# EAGLE board MotionDetectorCamera-Rev4 (EAGLE 9.6.2), part 1 of 2
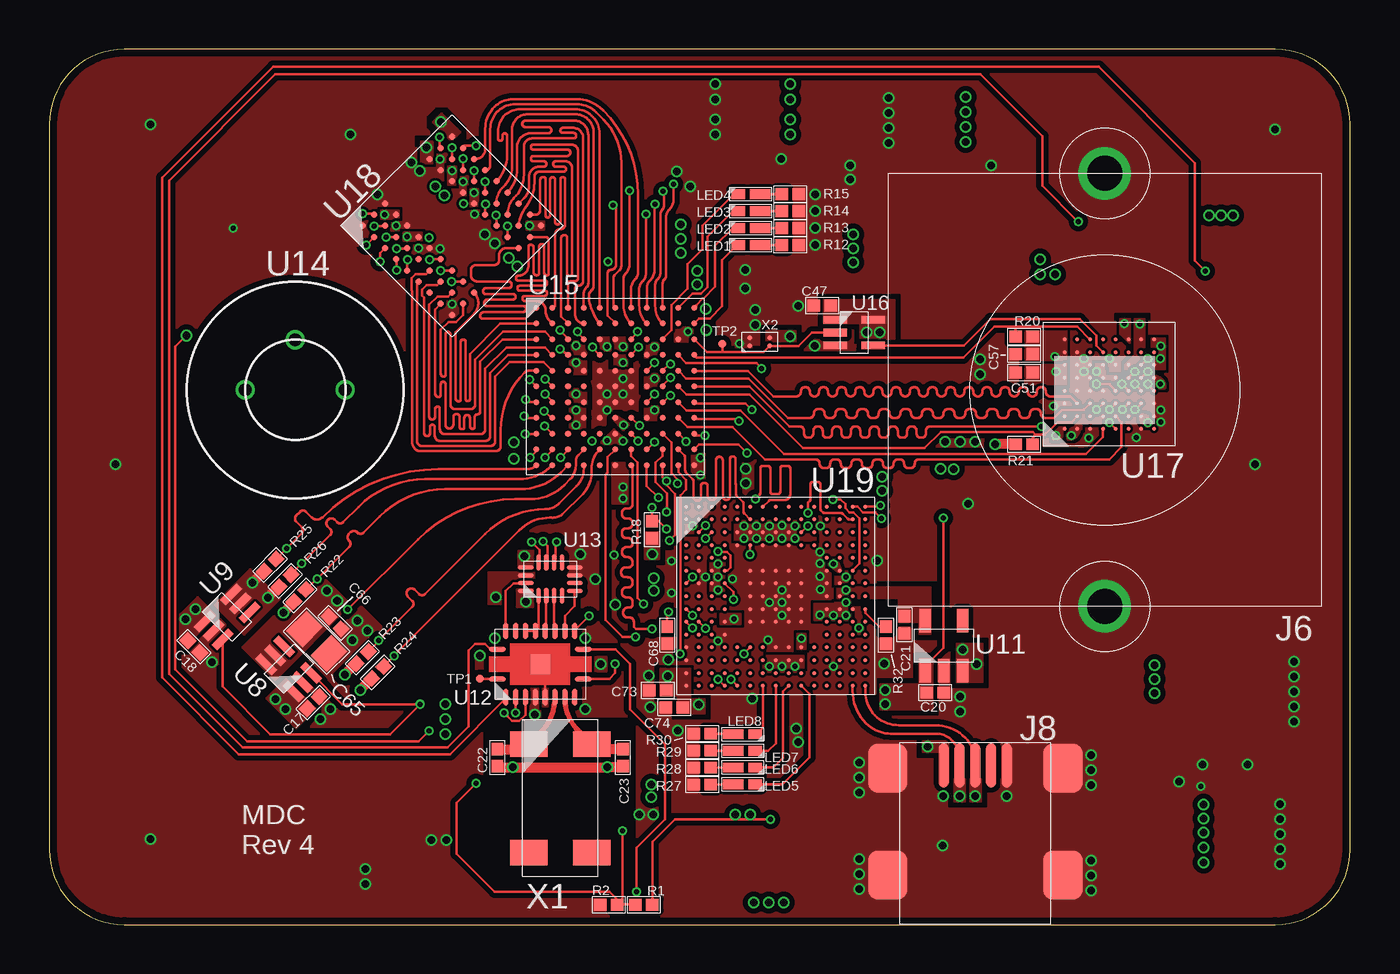
[diagram p9: board, top side]
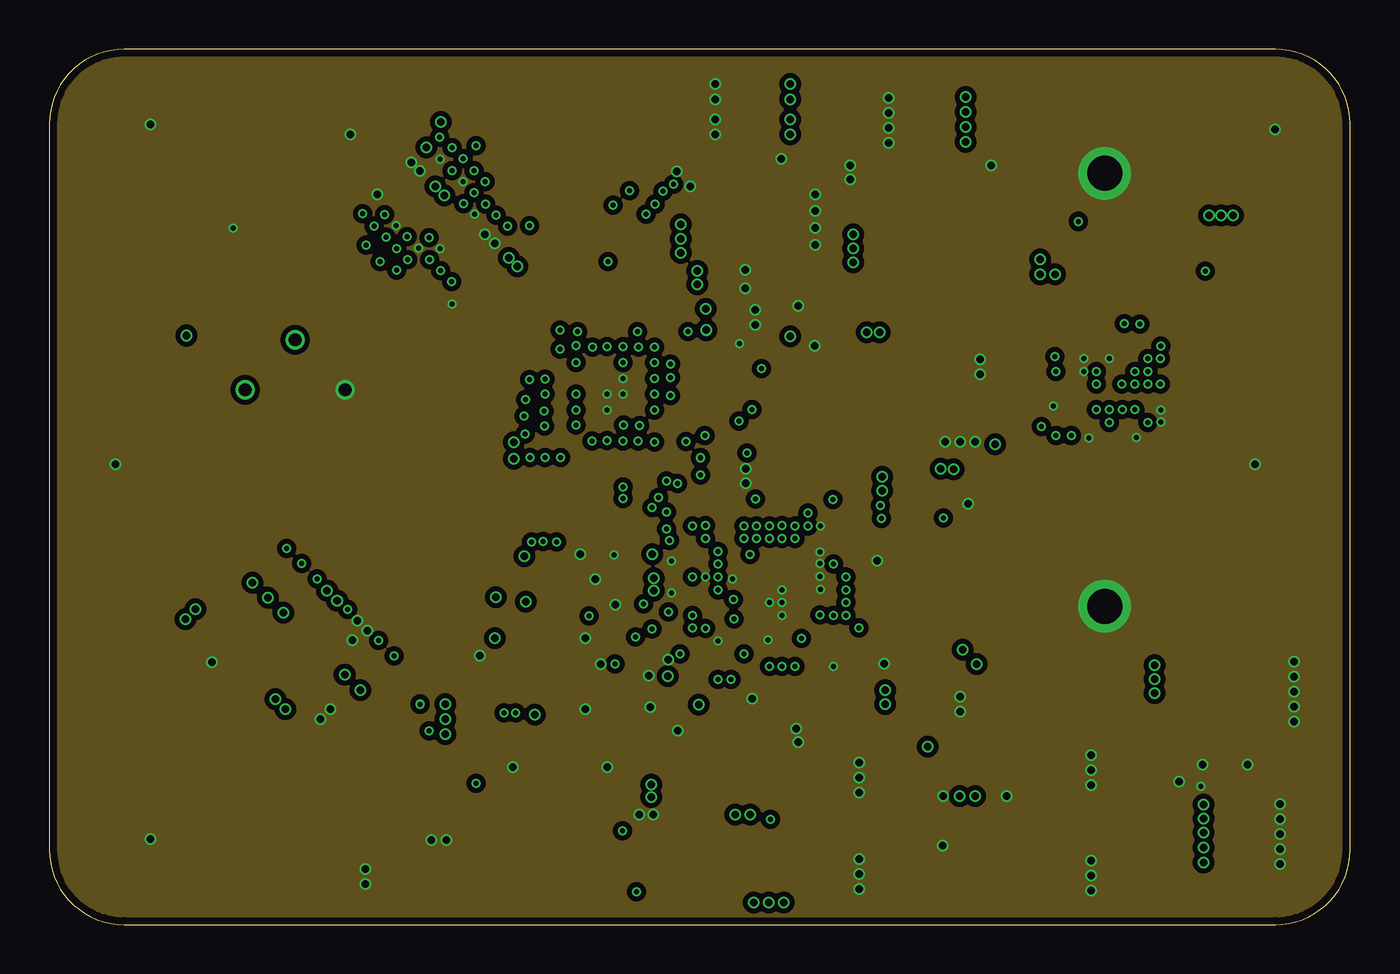
[diagram p10: board, inner layer Ground]
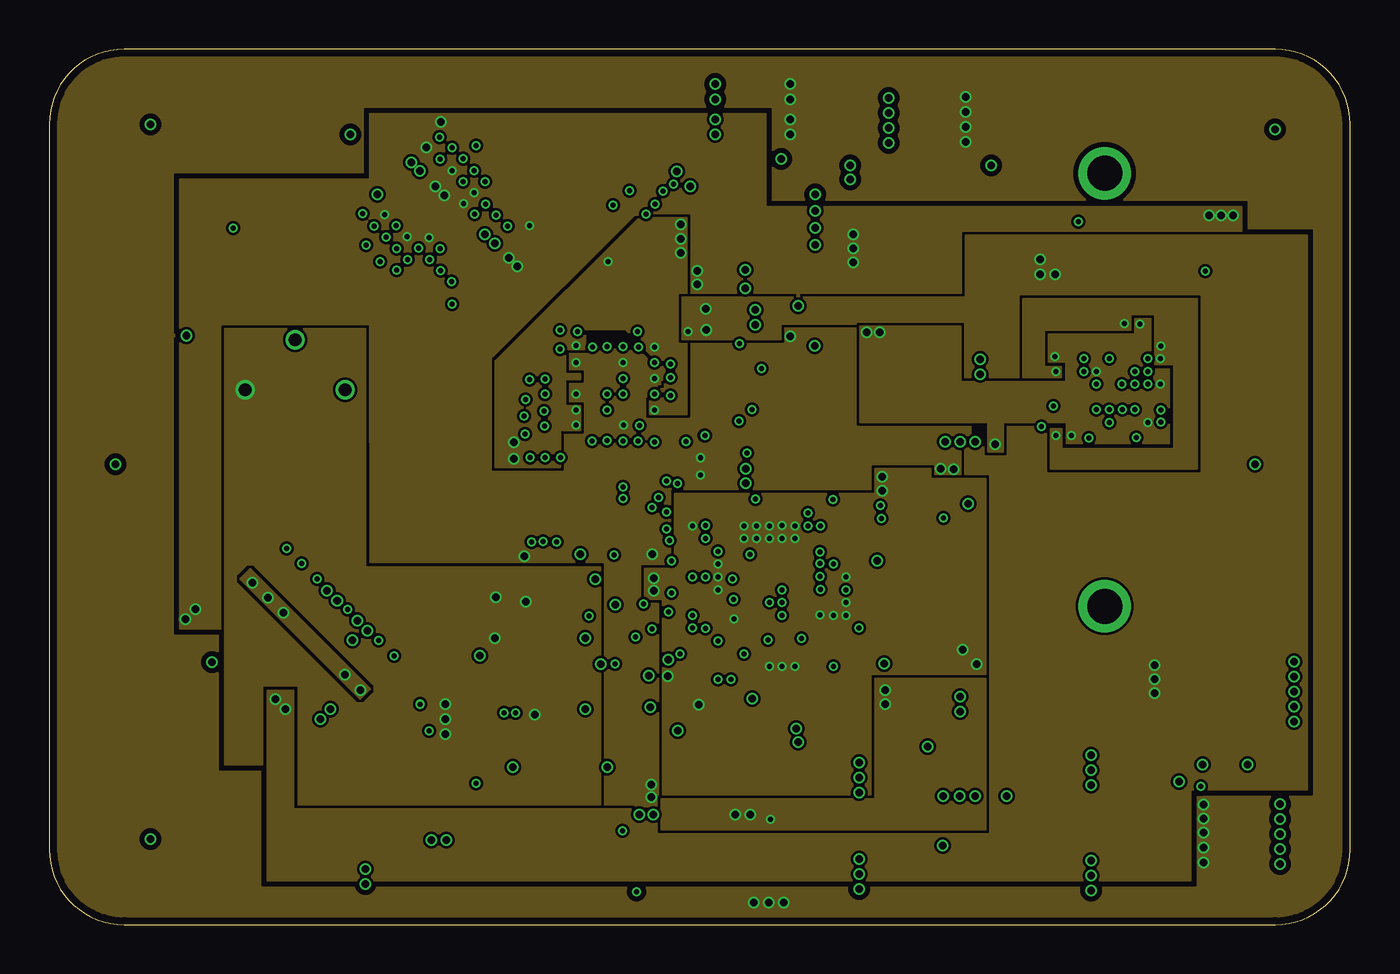
[diagram p11: board, inner layer Power]
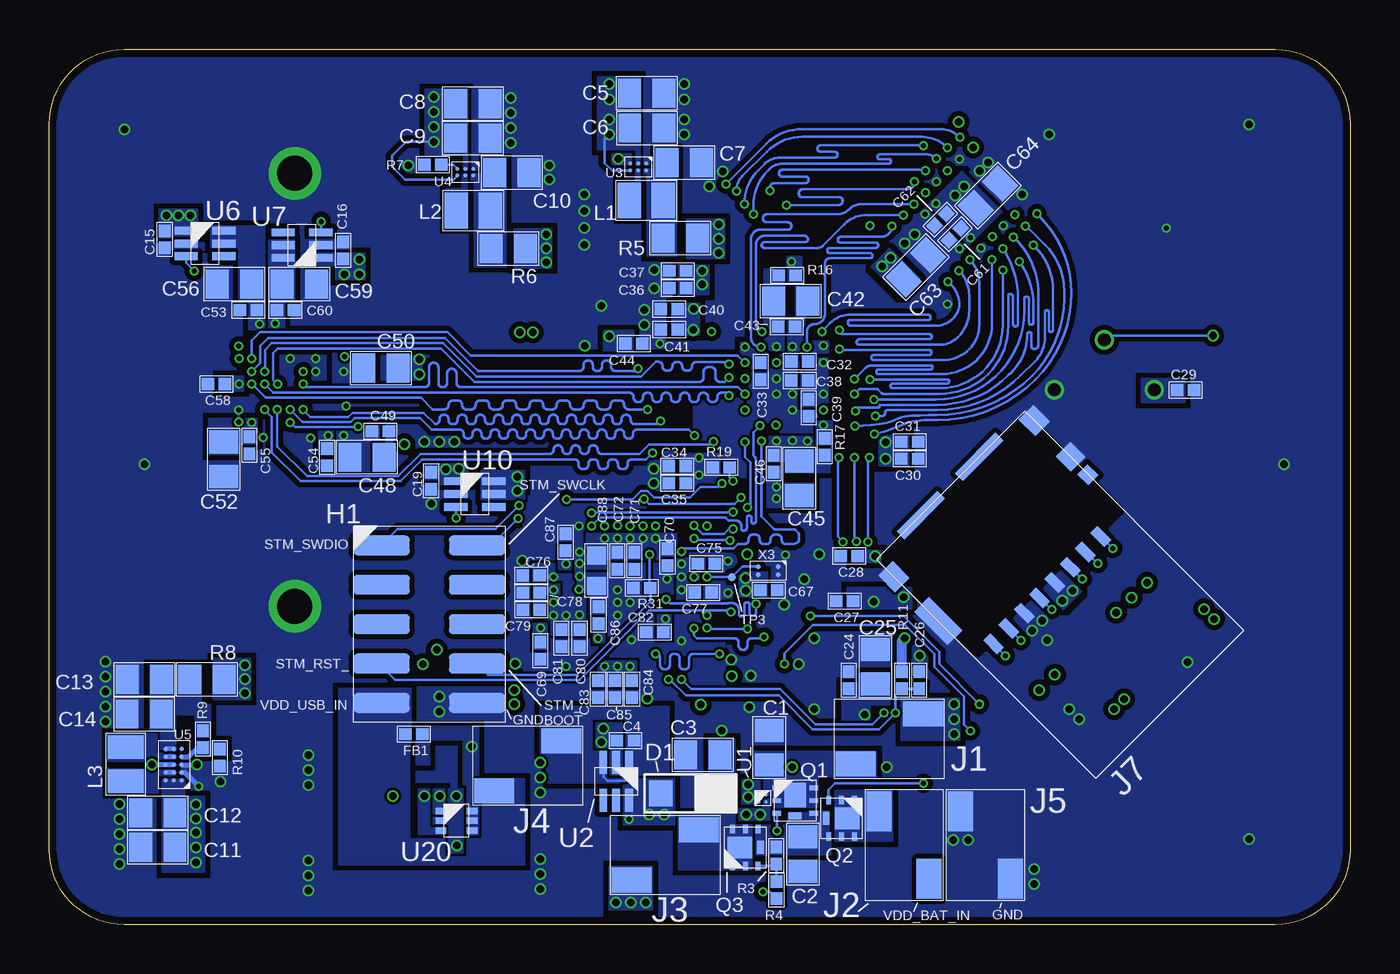
[diagram p12: board, bottom side, seen from below]

Size 66.09 x 44.48 mm. Coordinates in mm from the lower left corner, seen from the top.
Outline: 0,40.66 0,3.81 arc90 3.81,0 62.28,0 arc90 66.09,3.81 66.09,40.66 arc90 62.28,44.48 3.81,44.48 arc90 0,40.66
Copper layers (1*2*15*16): Top 0.035559375mm / dielectric 0.17018125mm / Ground 0.01778125mm / dielectric 47mil / Power 0.01778125mm / dielectric 0.17018125mm / Bottom 0.035559375mm
Design rules "oshpark-4layer *": minimum track width 5mil, minimum drill 10mil, track to track 5mil, track to pad 5mil, pad to pad 5mil, via to via 5mil, smd to smd 5mil, copper to edge 15mil, drill to drill 6mil, minimum pad ring 4mil, minimum via ring 4mil, stop-mask expansion 2.5mil, vias tented up to drill 25mil, thermal gap 10mil

## Footprints (pad centres in the part's own frame; a part is rotated, then mirrored left to right if it is on the bottom)
0805 = smd 1.165 x 1.465: 1 -0.875,0; 2 0.875,0
0402 = smd 0.635 x 0.6: 1 -0.432,0; 2 0.432,0
0603 = smd 0.921 x 0.97: 1 -0.775,0; 2 0.775,0
ROHM-RB168MM-40TFTR = smd 1.195 x 1.312: 1 -1.525,0; 2 1.525,0
TEC-1-2314844-0 = smd 2.85 x 1: 1 -2.425,4; 2 2.425,4; 3 -2.425,2; 4 2.425,2; 5 -2.425,0; 6 2.425,0; 7 -2.425,-2; 8 2.425,-2; 9 -2.425,-4; 10 2.425,-4
AMPHENOL-10129380-902002ALF = smd 1.27 x 2.03: 1 -1.27,1.715; 2 1.27,-1.715
S-MOUNT-LENS-HOLDER = drill 1.778: 1 -10.998,0; 2 10.998,0
MOLEX-1051620001 = smd 0.5 x 1: CLK -0.85,0.632; CMD 1.35,0.632; DAT0 -3.05,0.632; DAT1 -4.15,0.632; DAT2 3.55,0.632; DAT3 2.45,0.632; VDD 0.25,0.632; VSS -1.95,0.632 | smd 0.72 x 0.78: DET 5.31,3.312 | smd 1.05 x 1.08: GND1 5.325,4.582 | smd 1.05 x 1.2: GND2 5.325,7.192; GND3 -5.325,6.622 | smd 1.05 x 2.39: GND4 -5.325,3.438 | smd 2.91 x 0.55: NC1 -2.145,7.867; NC2 2.045,7.867
AMPHENOL-10033526-N3222MLF = smd 0.5 x 2.25: D+ 0,2.85; D- -0.8,2.85; GND 1.6,2.85; ID 0.8,2.85; VCC -1.6,2.85 | smd 2 x 2.5: GND2 -4.45,2.725; GND3 -4.45,-2.725; GND4 4.45,-2.725; GND5 4.45,2.725
0806 = smd 1.196 x 1.815: 1 -0.86,0; 2 0.86,0
LED-0603 = smd 0.7 x 0.5: A -0.641,0 | smd 1.05 x 0.5: C 0.475,0
NEXPERIA-SOT1220 = smd 0.43 x 0.25: 1 -0.935,0.65; 2 -0.935,0; 3 -0.935,-0.65; 4 0.935,-0.65; 5 0.935,0; 6 0.935,0.65 | smd 1.1 x 1.25: 7 0,0.285 | smd 0.66 x 0.35: 8 0,-0.775
TEST-POINT = smd 0.4 x 0.4: X 0,0
MAXIM-MAX40203ANS+T = smd 0.18 x 0.18: A1 -0.175,0.175; A2 0.175,0.175; B1 -0.175,-0.175; B2 0.175,-0.175
TI-TPS22919DCK = smd 1.186 x 0.397: 1 -0.962,0.65; 2 -0.962,0; 3 -0.962,-0.65; 4 0.962,-0.65; 5 0.962,0; 6 0.962,0.65
TI-TPS6280XYKAR = smd 0.2 x 0.2: A1 -0.175,0.406; A2 0.175,0.406; B1 -0.175,0; B2 0.175,0; C1 -0.175,-0.406; C2 0.175,-0.406
TI-TPS63805YFFR = smd 0.23 x 0.23: A1 -0.4,0.8; A2 0,0.8; A3 0.4,0.8; B1 -0.4,0.4; B2 0,0.4; B3 0.4,0.4; C1 -0.4,0; C2 0,0; C3 0.4,0; D1 -0.4,-0.4; D2 0,-0.4; D3 0.4,-0.4; E1 -0.4,-0.8; E2 0,-0.8; E3 0.4,-0.8
MICROCHIP-MIC550X-SOT23-5 = smd 1.186 x 0.584: 1 -1.264,0.95; 2 -1.264,0; 3 -1.264,-0.95; 4 1.264,-0.95; 5 1.264,0.95
TI-MSP430FR2422IRHL = smd 0.26 x 0.86: 1 -0.75,2.185; 10 -0.75,-2.185; 11 0.75,-2.185; 20 0.75,2.185 | smd 0.86 x 0.26: 2 -1.685,1.75; 3 -1.685,1.25; 4 -1.685,0.75; 5 -1.685,0.25; 6 -1.685,-0.25; 7 -1.685,-0.75; 8 -1.685,-1.25; 9 -1.685,-1.75; 12 1.685,-1.75; 13 1.685,-1.25; 14 1.685,-0.75; 15 1.685,-0.25; 16 1.685,0.25; 17 1.685,0.75; 18 1.685,1.25; 19 1.685,1.75 | smd 1 x 1: 21 0,0
TI-SN74AXC4T774RSV = smd 0.81 x 0.22: 1 -0.845,0.6; 2 -0.845,0.2; 3 -0.845,-0.2; 4 -0.845,-0.6; 9 0.845,-0.6; 10 0.845,-0.2; 11 0.845,0.2; 12 0.845,0.6 | smd 0.22 x 0.81: 5 -0.6,-1.245; 6 -0.2,-1.245; 7 0.2,-1.245; 8 0.6,-1.245; 13 0.6,1.245; 14 0.2,1.245; 15 -0.2,1.245; 16 -0.6,1.245
PANASONIC-EKMB110711X = drill 0.65: 1 -2.54,0; 2 0,2.54; 3 2.54,0
LATTICE-ICE40HX4K-BG121 = smd 0.3 x 0.3: A1 -4,4; A2 -3.2,4; A3 -2.4,4; A4 -1.6,4; A5 -0.8,4; A6 0,4; A7 0.8,4; A8 1.6,4; A9 2.4,4; A10 3.2,4; A11 4,4; B1 -4,3.2; B2 -3.2,3.2; B3 -2.4,3.2; B4 -1.6,3.2; B5 -0.8,3.2; B6 0,3.2; B7 0.8,3.2; B8 1.6,3.2; B9 2.4,3.2; B10 3.2,3.2; B11 4,3.2; C1 -4,2.4; C2 -3.2,2.4; C3 -2.4,2.4; C4 -1.6,2.4; C5 -0.8,2.4; C6 0,2.4; C7 0.8,2.4; C8 1.6,2.4; C9 2.4,2.4; C10 3.2,2.4; C11 4,2.4; D1 -4,1.6; D2 -3.2,1.6; D3 -2.4,1.6; D4 -1.6,1.6; D5 -0.8,1.6; D6 0,1.6; D7 0.8,1.6; D8 1.6,1.6; D9 2.4,1.6; D10 3.2,1.6; D11 4,1.6; E1 -4,0.8; E2 -3.2,0.8; E3 -2.4,0.8; E4 -1.6,0.8; E5 -0.8,0.8; E6 0,0.8; E7 0.8,0.8; E8 1.6,0.8; E9 2.4,0.8; E10 3.2,0.8; E11 4,0.8; F1 -4,0; F2 -3.2,0; F3 -2.4,0; F4 -1.6,0; F5 -0.8,0; F6 0,0; F7 0.8,0; F8 1.6,0; F9 2.4,0; F10 3.2,0; F11 4,0; G1 -4,-0.8; G2 -3.2,-0.8; G3 -2.4,-0.8; G4 -1.6,-0.8; G5 -0.8,-0.8; G6 0,-0.8; G7 0.8,-0.8; G8 1.6,-0.8; G9 2.4,-0.8; G10 3.2,-0.8; G11 4,-0.8; H1 -4,-1.6; H2 -3.2,-1.6; H3 -2.4,-1.6; H4 -1.6,-1.6; H5 -0.8,-1.6; H6 0,-1.6; H7 0.8,-1.6; H8 1.6,-1.6; H9 2.4,-1.6; H10 3.2,-1.6; H11 4,-1.6; J1 -4,-2.4; J2 -3.2,-2.4; J3 -2.4,-2.4; J4 -1.6,-2.4; J5 -0.8,-2.4; J6 0,-2.4; J7 0.8,-2.4; J8 1.6,-2.4; J9 2.4,-2.4; J10 3.2,-2.4; J11 4,-2.4; K1 -4,-3.2; K2 -3.2,-3.2; K3 -2.4,-3.2; K4 -1.6,-3.2; K5 -0.8,-3.2; K6 0,-3.2; K7 0.8,-3.2; K8 1.6,-3.2; K9 2.4,-3.2; K10 3.2,-3.2; K11 4,-3.2; L1 -4,-4; L2 -3.2,-4; L3 -2.4,-4; L4 -1.6,-4; L5 -0.8,-4; L6 0,-4; L7 0.8,-4; L8 1.6,-4; L9 2.4,-4; L10 3.2,-4; L11 4,-4
TI-SN74LVC1G126DCK = smd 1.186 x 0.397: 1 -0.962,0.65; 2 -0.962,0; 3 -0.962,-0.65; 4 0.962,-0.65; 5 0.962,0.65
ON-AR0330CS1C12SPKA0 = smd 0.2 x 0.2: A1 -1.985,2.045; A2 -1.335,2.045; A3 -0.685,2.045; A4 -0.035,2.045; A5 0.615,2.045; A6 1.265,2.045; A7 1.915,2.045; A8 2.565,2.045; B1 -1.985,1.395; B2 -1.335,1.395; B3 -0.685,1.395; B4 -0.035,1.395; B5 0.615,1.395; B6 1.265,1.395; B7 1.915,1.395; B8 2.565,1.395; C1 -1.985,0.745; C2 -1.335,0.745; C3 -0.685,0.745; C4 -0.035,0.745; C5 0.615,0.745; C6 1.265,0.745; C7 1.915,0.745; C8 2.565,0.745; D1 -1.985,0.095; D2 -1.335,0.095; D3 -0.685,0.095; D4 -0.035,0.095; D5 0.615,0.095; D6 1.265,0.095; D7 1.915,0.095; D8 2.565,0.095; E1 -1.985,-0.555; E2 -1.335,-0.555; E3 -0.685,-0.555; E4 -0.035,-0.555; E5 0.615,-0.555; E6 1.265,-0.555; E7 1.915,-0.555; E8 2.565,-0.555; F1 -1.985,-1.205; F2 -1.335,-1.205; F3 -0.685,-1.205; F4 -0.035,-1.205; F5 0.615,-1.205; F6 1.265,-1.205; F7 1.915,-1.205; F8 2.565,-1.205; G1 -1.985,-1.855; G2 -1.335,-1.855; G3 -0.685,-1.855; G4 -0.035,-1.855; G5 0.615,-1.855; G6 1.265,-1.855; G7 1.915,-1.855; G8 2.565,-1.855; H1 -1.985,-2.505; H2 -1.335,-2.505; H3 -0.685,-2.505; H4 -0.035,-2.505; H5 0.615,-2.505; H6 1.265,-2.505; H7 1.915,-2.505; H8 2.565,-2.505
ALLIANCE-AS4C8M16MSA-6BIN = smd 0.33 x 0.33: A1 -3.2,3.2; A2 -2.4,3.2; A3 -1.6,3.2; A7 1.6,3.2; A8 2.4,3.2; A9 3.2,3.2; B1 -3.2,2.4; B2 -2.4,2.4; B3 -1.6,2.4; B7 1.6,2.4; B8 2.4,2.4; B9 3.2,2.4; C1 -3.2,1.6; C2 -2.4,1.6; C3 -1.6,1.6; C7 1.6,1.6; C8 2.4,1.6; C9 3.2,1.6; D1 -3.2,0.8; D2 -2.4,0.8; D3 -1.6,0.8; D7 1.6,0.8; D8 2.4,0.8; D9 3.2,0.8; E1 -3.2,0; E2 -2.4,0; E3 -1.6,0; E7 1.6,0; E8 2.4,0; E9 3.2,0; F1 -3.2,-0.8; F2 -2.4,-0.8; F3 -1.6,-0.8; F7 1.6,-0.8; F8 2.4,-0.8; F9 3.2,-0.8; G1 -3.2,-1.6; G2 -2.4,-1.6; G3 -1.6,-1.6; G7 1.6,-1.6; G8 2.4,-1.6; G9 3.2,-1.6; H1 -3.2,-2.4; H2 -2.4,-2.4; H3 -1.6,-2.4; H7 1.6,-2.4; H8 2.4,-2.4; H9 3.2,-2.4; J1 -3.2,-3.2; J2 -2.4,-3.2; J3 -1.6,-3.2; J7 1.6,-3.2; J8 2.4,-3.2; J9 3.2,-3.2
STM-STM32F730I8 = smd 0.2 x 0.2: A1 -4.55,4.55; A2 -3.9,4.55; A3 -3.25,4.55; A4 -2.6,4.55; A5 -1.95,4.55; A6 -1.3,4.55; A7 -0.65,4.55; A8 0,4.55; A9 0.65,4.55; A10 1.3,4.55; A11 1.95,4.55; A12 2.6,4.55; A13 3.25,4.55; A14 3.9,4.55; A15 4.55,4.55; B1 -4.55,3.9; B2 -3.9,3.9; B3 -3.25,3.9; B4 -2.6,3.9; B5 -1.95,3.9; B6 -1.3,3.9; B7 -0.65,3.9; B8 0,3.9; B9 0.65,3.9; B10 1.3,3.9; B11 1.95,3.9; B12 2.6,3.9; B13 3.25,3.9; B14 3.9,3.9; B15 4.55,3.9; C1 -4.55,3.25; C2 -3.9,3.25; C3 -3.25,3.25; C4 -2.6,3.25; C5 -1.95,3.25; C6 -1.3,3.25; C7 -0.65,3.25; C8 0,3.25; C9 0.65,3.25; C10 1.3,3.25; C11 1.95,3.25; C12 2.6,3.25; C13 3.25,3.25; C14 3.9,3.25; C15 4.55,3.25; D1 -4.55,2.6; D2 -3.9,2.6; D3 -3.25,2.6; D4 -2.6,2.6; D5 -1.95,2.6; D6 -1.3,2.6; D7 -0.65,2.6; D8 0,2.6; D9 0.65,2.6; D10 1.3,2.6; D11 1.95,2.6; D12 2.6,2.6; D13 3.25,2.6; D14 3.9,2.6; D15 4.55,2.6; E1 -4.55,1.95; E2 -3.9,1.95; E3 -3.25,1.95; E4 -2.6,1.95; E12 2.6,1.95; E13 3.25,1.95; E14 3.9,1.95; E15 4.55,1.95; F1 -4.55,1.3; F2 -3.9,1.3; F3 -3.25,1.3; F4 -2.6,1.3; F6 -1.3,1.3; F7 -0.65,1.3; F8 0,1.3; F9 0.65,1.3; F10 1.3,1.3; F12 2.6,1.3; F13 3.25,1.3; F14 3.9,1.3; F15 4.55,1.3; G1 -4.55,0.65; G2 -3.9,0.65; G3 -3.25,0.65; G4 -2.6,0.65; G6 -1.3,0.65; G7 -0.65,0.65; G8 0,0.65; G9 0.65,0.65; G10 1.3,0.65; G12 2.6,0.65; G13 3.25,0.65; G14 3.9,0.65; G15 4.55,0.65; H1 -4.55,0; H2 -3.9,0; H3 -3.25,0; H4 -2.6,0; H6 -1.3,0; H7 -0.65,0; H8 0,0; H9 0.65,0; H10 1.3,0; H12 2.6,0; H13 3.25,0; H14 3.9,0; H15 4.55,0; J1 -4.55,-0.65; J2 -3.9,-0.65; J3 -3.25,-0.65; J4 -2.6,-0.65; J6 -1.3,-0.65; J7 -0.65,-0.65; J8 0,-0.65; J9 0.65,-0.65; J10 1.3,-0.65; J12 2.6,-0.65; J13 3.25,-0.65; J14 3.9,-0.65; J15 4.55,-0.65; K1 -4.55,-1.3; K2 -3.9,-1.3; K3 -3.25,-1.3; K4 -2.6,-1.3; K6 -1.3,-1.3; K7 -0.65,-1.3; K8 0,-1.3; K9 0.65,-1.3; K10 1.3,-1.3; K12 2.6,-1.3; K13 3.25,-1.3; K14 3.9,-1.3; K15 4.55,-1.3; L1 -4.55,-1.95; L2 -3.9,-1.95; L3 -3.25,-1.95; L4 -2.6,-1.95; L12 2.6,-1.95; L13 3.25,-1.95; L14 3.9,-1.95; L15 4.55,-1.95; M1 -4.55,-2.6; M2 -3.9,-2.6; M3 -3.25,-2.6; M4 -2.6,-2.6; M5 -1.95,-2.6; M6 -1.3,-2.6; M7 -0.65,-2.6; M8 0,-2.6; M9 0.65,-2.6; M10 1.3,-2.6; M11 1.95,-2.6; M12 2.6,-2.6; M13 3.25,-2.6; M14 3.9,-2.6; M15 4.55,-2.6; N1 -4.55,-3.25; N2 -3.9,-3.25; N3 -3.25,-3.25; N4 -2.6,-3.25; N5 -1.95,-3.25; N6 -1.3,-3.25; N7 -0.65,-3.25; N8 0,-3.25; N9 0.65,-3.25; N10 1.3,-3.25; N11 1.95,-3.25; N12 2.6,-3.25; N13 3.25,-3.25; N14 3.9,-3.25; N15 4.55,-3.25; P1 -4.55,-3.9; P2 -3.9,-3.9; P3 -3.25,-3.9; P4 -2.6,-3.9; P5 -1.95,-3.9; P6 -1.3,-3.9; P7 -0.65,-3.9; P8 0,-3.9; P9 0.65,-3.9; P10 1.3,-3.9; P11 1.95,-3.9; P12 2.6,-3.9; P13 3.25,-3.9; P14 3.9,-3.9; P15 4.55,-3.9; R1 -4.55,-4.55; R2 -3.9,-4.55; R3 -3.25,-4.55; R4 -2.6,-4.55; R5 -1.95,-4.55; R6 -1.3,-4.55; R7 -0.65,-4.55; R8 0,-4.55; R9 0.65,-4.55; R10 1.3,-4.55; R11 1.95,-4.55; R12 2.6,-4.55; R13 3.25,-4.55; R14 3.9,-4.55; R15 4.55,-4.55
DIODESINC-DT1446-04V-7 = smd 0.546 x 0.337: 1 -0.796,0.5; 2 -0.796,0; 3 -0.796,-0.5; 4 0.796,-0.5; 5 0.796,0; 6 0.796,0.5
EPSON-MC-306 = smd 1.3 x 1.9: 1 -2.75,-1.6; 2 2.75,-1.6; 3 2.75,1.6; 4 -2.75,1.6
SITIME-SIT8021 = smd 0.25 x 0.25: 1 -0.205,0.5; 2 -0.205,-0.5; 3 0.205,-0.5; 4 0.205,0.5

## Placement (x,y rotation side)
C1  10u  [0805]  29.51,8.99 90 bottom
C2  10u  [0805]  27.8,3.58 270 bottom
C3  10u  [0805]  32.9,8.62 180 bottom
C4  2.2u  [0402]  36.82,9.35 180 bottom
C5  10u  [0805]  35.73,42.24 0 bottom
C6  10u  [0805]  35.73,40.47 0 bottom
C7  10u  [0805]  33.84,38.72 0 bottom
C8  10u  [0805]  44.57,41.71 0 bottom
C9  10u  [0805]  44.57,39.96 0 bottom
C10  10u  [0805]  42.6,38.21 0 bottom
C11  10u  [0805]  60.58,3.92 180 bottom
C12  10u  [0805]  60.58,5.68 180 bottom
C13  10u  [0805]  61.26,12.45 180 bottom
C14  10u  [0805]  61.26,10.69 180 bottom
C15  2.2u  [0402]  60.23,34.82 270 bottom
C16  2.2u  [0402]  51.16,34.24 90 bottom
C17  2.2u  [0402]  13.41,11.28 45 top
C18  2.2u  [0402]  7.35,14.12 315 top
C19  2.2u  [0402]  46.69,22.56 270 bottom
C20  2.2u  [0402]  45.01,11.79 0 top
C21  2.2u  [0402]  43.44,15.23 270 top
C22  9p  [0402]  22.76,8.48 270 top
C23  9p  [0402]  29.14,8.48 270 top
C24  100n  [0402]  25.48,12.41 90 bottom
C25  10u  [0805]  24.13,13.11 90 bottom
C26  1n  [0402]  21.89,12.42 90 bottom
C27  100n  [0402]  25.68,16.43 180 bottom
C28  100n  [0402]  25.45,18.74 180 bottom
C29  100n  [0402]  8.36,27.15 0 bottom
C30  100n  [0402]  22.38,23.67 0 bottom
C31  10n  [0402]  22.38,24.53 0 bottom
C32  100n  [0402]  27.97,28.6 180 bottom
C33  10n  [0402]  29.95,28.12 270 bottom
C34  100n  [0402]  34.19,23.29 180 bottom
C35  10n  [0402]  34.19,22.43 180 bottom
C36  100n  [0402]  34.16,32.33 180 bottom
C37  10n  [0402]  34.16,33.21 180 bottom
C38  100n  [0402]  27.97,27.64 180 bottom
C39  10n  [0402]  27.51,26.26 270 bottom
C40  100n  [0402]  34.59,31.27 180 bottom
C41  10n  [0402]  34.59,30.23 180 bottom
C42  10u  [0805]  28.43,31.68 0 bottom
C43  100n  [0402]  28.62,30.38 0 bottom
C44  10n  [0402]  36.4,29.51 0 bottom
C45  10u  [0805]  27.99,22.68 270 bottom
C46  100n  [0402]  29.29,23.42 270 bottom
C47  100n  [0402]  39.26,31.45 180 top
C48  10u  [0805]  49.94,23.75 0 bottom
C49  100n  [0402]  49.28,25.07 0 bottom
C50  10u  [0805]  49.25,28.28 0 bottom
C51  100n  [0402]  49.53,28.05 180 top
C52  10u  [0805]  57.23,23.65 270 bottom
C53  100n  [0402]  55.98,31.22 180 bottom
C54  100n  [0402]  51.98,23.74 270 bottom
C55  100n  [0402]  55.92,24.36 270 bottom
C56  10u  [0805]  56.69,32.53 180 bottom
C57  100n  [0402]  49.53,28.98 180 top
C58  100n  [0402]  57.61,27.46 180 bottom
C59  10u  [0805]  53.38,32.53 0 bottom
C60  100n  [0402]  54.08,31.22 0 bottom
C61  100n  [0402]  20.08,35.08 225 bottom
C62  100n  [0402]  20.82,35.81 225 bottom
C63  10u  [0805]  22.06,33.4 45 bottom
C64  10u  [0805]  18.4,37.03 45 bottom
C65  10u  [0805]  13.59,14.4 315 top
C66  100n  [0402]  14.52,15.33 315 top
C67  10n  [0402]  29.54,16.99 0 bottom
C68  100n  [0402]  31.39,14.72 270 top
C69  2.2u  [0402]  41.15,13.92 270 bottom
C70  100n  [0402]  34.68,18.67 270 bottom
C71  100n  [0402]  36.37,18.49 270 bottom
C72  100n  [0402]  37.24,18.49 270 bottom
C73  100n  [0402]  30.91,11.9 180 top
C74  2.2u  [0402]  31.76,11.04 180 top
C75  100n  [0402]  32.72,18.34 0 bottom
C76  100n  [0402]  41.59,17.73 180 bottom
C77  100n  [0402]  32.87,16.87 0 bottom
C78  100n  [0402]  41.6,16.86 180 bottom
C79  2.2u  [0402]  41.6,15.99 180 bottom
C80  100n  [0402]  39.15,14.56 270 bottom
C81  100n  [0402]  40.07,14.56 270 bottom
C82  100n  [0402]  35.33,14.85 180 bottom
C83  100n  [0402]  38.21,11.97 270 bottom
C84  100n  [0402]  36.48,11.97 270 bottom
C85  100n  [0402]  37.35,11.97 270 bottom
C86  2.2u  [0402]  38.19,15.71 90 bottom
C87  2.2u  [0402]  39.87,19.43 90 bottom
C88  4.7u  [0603]  38.29,17.99 270 bottom
D1  ROHM-RB168MM-40TFTR  [ROHM-RB168MM-40TFTR]  33.51,6.66 0 bottom
FB1  FERRITE-BEAD0402  [0402]  47.57,9.67 180 bottom
H1  HEADER-2X5  [TEC-1-2314844-0]  46.79,15.27 0 bottom
J1  JUMPER  [AMPHENOL-10129380-902002ALF]  23.42,9.44 90 bottom
J2  JUMPER  [AMPHENOL-10129380-902002ALF]  22.66,4.04 180 bottom
J3  JUMPER  [AMPHENOL-10129380-902002ALF]  34.8,3.53 270 bottom
J4  JUMPER  [AMPHENOL-10129380-902002ALF]  41.79,8.08 90 bottom
J5  JUMPER  [AMPHENOL-10129380-902002ALF]  18.54,4.04 0 bottom
J6  S-MOUNT-LENS-HOLDER  [S-MOUNT-LENS-HOLDER]  53.62,27.17 90 top
J7  MICROSD-SOCKET  [MOLEX-1051620001]  14.73,16.76 45 bottom
J8  MINI-USB-JACK  [AMPHENOL-10033526-N3222MLF]  47.04,5.23 0 top
L1  470n  [0806]  35.76,36.79 0 bottom
L2  470n  [0806]  44.54,36.27 0 bottom
L3  470n  [0806]  62.2,8.15 90 bottom
LED1  LED  [LED-0603]  35.64,34.53 0 top
LED2  LED  [LED-0603]  35.64,35.39 0 top
LED3  LED  [LED-0603]  35.64,36.25 0 top
LED4  LED  [LED-0603]  35.64,37.11 0 top
LED5  LED  [LED-0603]  35.22,7.13 180 top
LED6  LED  [LED-0603]  35.22,7.98 180 top
LED7  LED  [LED-0603]  35.22,8.83 180 top
LED8  LED  [LED-0603]  35.22,9.68 180 top
Q1  PMOS-NEXPERIA-SOT1220  [NEXPERIA-SOT1220]  28.2,6.3 0 bottom
Q2  PMOS-NEXPERIA-SOT1220  [NEXPERIA-SOT1220]  25.85,5.4 270 bottom
Q3  PMOS-NEXPERIA-SOT1220  [NEXPERIA-SOT1220]  30.73,3.92 90 bottom
R1  3k  [0402]  30.21,1.01 0 top
R2  100k  [0402]  28.43,1.01 0 top
R3  100k  [0402]  29.16,3.52 270 bottom
R4  3k  [0402]  29.15,1.75 270 bottom
R5  0  [0805]  34.04,34.87 180 bottom
R6  0  [0805]  42.76,34.34 180 bottom
R7  12.1k  [0402]  46.6,38.61 0 bottom
R8  0  [0805]  58.07,12.46 180 bottom
R9  422k  [0402]  58.28,9.42 90 bottom
R10  91k  [0402]  57.42,8.48 90 bottom
R11  47k  [0402]  22.77,12.42 90 bottom
R12  1.8k  [0402]  37.64,34.53 0 top
R13  1.8k  [0402]  37.64,35.39 0 top
R14  1.8k  [0402]  37.64,36.25 0 top
R15  1.8k  [0402]  37.64,37.11 0 top
R16  100  [0402]  28.61,32.98 0 bottom
R17  100  [0402]  26.69,24.28 90 bottom
R18  10k  [0402]  30.62,20.06 90 top
R19  10k  [0402]  31.96,23.23 0 bottom
R20  10k  [0402]  49.53,29.87 0 top
R21  10k  [0402]  49.53,24.4 0 top
R22  47k  [0402]  12.73,16.72 225 top
R23  47k  [0402]  15.9,13.57 225 top
R24  47k  [0402]  16.69,12.81 225 top
R25  47k  [0402]  11.22,18.27 225 top
R26  47k  [0402]  11.98,17.47 225 top
R27  1.8k  [0402]  33.16,7.11 180 top
R28  1.8k  [0402]  33.16,7.98 180 top
R29  1.8k  [0402]  33.16,8.84 180 top
R30  1.8k  [0402]  33.16,9.7 180 top
R31  10k  [0402]  35.99,17.1 0 bottom
R32  3k  [0402]  42.5,14.71 90 top
TP1  TEST-POINT  [TEST-POINT]  21.88,12.49 0 top
TP2  TEST-POINT  [TEST-POINT]  34.19,29.51 0 top
TP3  TEST-POINT  [TEST-POINT]  31.43,17.65 180 bottom
U1  MAXIM-MAX40203ANS+T  [MAXIM-MAX40203ANS+T]  29.85,6.43 0 bottom
U2  TI-TPS22919DCK  [TI-TPS22919DCK]  37.29,7.28 270 bottom
U3  TI-TPS6280XYKAR  [TI-TPS6280XYKAR]  36.17,38.49 270 bottom
U4  TI-TPS6280XYKAR  [TI-TPS6280XYKAR]  44.95,38.23 270 bottom
U5  TI-TPS63805YFFR  [TI-TPS63805YFFR]  59.77,8.13 180 bottom
U6  TI-TPS22919DCK  [TI-TPS22919DCK]  58.17,34.61 0 bottom
U7  TI-TPS22919DCK  [TI-TPS22919DCK]  53.25,34.52 180 bottom
U8  TI-TPS22919DCK  [TI-TPS22919DCK]  12.17,13 135 top
U9  TI-TPS22919DCK  [TI-TPS22919DCK]  9.03,15.63 45 top
U10  TI-TPS22919DCK  [TI-TPS22919DCK]  44.48,21.88 0 bottom
U11  MICROCHIP-MIC550X  [MICROCHIP-MIC550X-SOT23-5]  45.44,14.17 90 top
U12  TI-MSP430FR2422IRHL  [TI-MSP430FR2422IRHL]  24.94,13.23 90 top
U13  TI-SN74AXC4T774RSV  [TI-SN74AXC4T774RSV]  25.45,17.55 90 top
U14  PANASONIC-EKMB110711X  [PANASONIC-EKMB110711X]  12.5,27.17 0 top
U15  LATTICE-ICE40HX4K-BG121  [LATTICE-ICE40HX4K-BG121]  28.76,27.34 0 top
U16  TI-SN74LVC1G126  [TI-SN74LVC1G126DCK]  40.89,30.08 0 top
U17  ON-AR0330CS1C12SPKA0  [ON-AR0330CS1C12SPKA0]  53.62,27.17 90 top
U18  ALLIANCE-AS4C8M16MSA-6BIN  [ALLIANCE-AS4C8M16MSA-6BIN]  20.45,35.5 45 top
U19  STM-STM32F730  [STM-STM32F730I8]  36.91,16.69 0 top
U20  DIODESINC-DT1446-04V-7  [DIODESINC-DT1446-04V-7]  45.4,5.28 0 bottom
X1  EPSON-MC-306  [EPSON-MC-306]  25.96,6.42 270 top
X2  SITIME-SIT8021  [SITIME-SIT8021]  36.09,29.61 90 top
X3  SITIME-SIT8021  [SITIME-SIT8021]  29.57,17.98 270 bottom

## Tracks (layer width: path | path; a pad name or v marks a point on that pad's centre or on a via)
CLEAR
  pour Bottom (isolate 0.508, rank 5, no thermals): 60.91,6.81 58.78,6.81 58.78,9.55 60.91,9.55
GND  (via drill 0.25, 0.38)
  Top 0.127: U12.6 25.19,13.23 U12.21
  Top 0.508: C22.2 22.81,8 v23.55,8 v28.35,8 29.09,8 C23.2
  Bottom 0.254: U5.C2 U5.C3 v60.88,8.13 | U5.C1 v58.58,8.13 | U5.B1 59.21,7.73 v58.49,7.01
  other vias: 29.16,27.74 29.16,26.95 28.35,26.95 28.35,26.14 35.39,22.42 35.06,29.52 35.85,30.47 35.36,32.33 35.36,33.26 35.37,23.17 57.4,7.26 46.28,10.82 46.28,11.58 28.75,16.24 31.61,18.48 31.62,16.85 37.23,17.01 37.23,16.37 37.23,15.72 36.58,16.36 30.53,11.05 30.45,12.65 31.44,13.45 33.33,17.67 40.69,38.57 40.69,37.85 18.39,38.73 18.82,38.29 22.13,35.07 22.63,34.62 16.66,37.1 17.63,35.51 18.78,34.37 20.46,31.53 9.33,35.38 19.86,38.89 21.02,37.75 37.2,38.9 47.85,38.58 39.17,17.02 36.5,14.48 34.72,17.55 48.63,6.53 52.92,8.62 52.92,7.86 52.92,7.1 52.92,3.25 52.92,2.48 52.92,1.72 41.15,1.8 41.15,2.57 41.15,3.33 33.98,14.41 39.14,18.35 39.15,18.94 39.16,17.68 39.83,13.11 39.18,20.26 35.85,31.23 32.56,37.51 31.88,38.25 35.72,11.49 19.86,34.34 21.61,36.09 42.07,18.48 42.42,13.25 28.69,18.79 33.83,42.7 33.83,41.94 33.83,40.92 33.83,40.16 42.63,42 42.63,41.24 42.63,40.47 42.63,39.71 62.53,6.12 62.53,5.36 62.53,4.6 62.53,3.84 62.53,3.07 63.23,13.37 63.23,12.61 63.23,11.85 63.23,11.08 63.23,10.32 62.28,40.41 15.29,40.16 38.04,31.42 38.89,29.42 45.38,4.02 45.42,6.52 41.15,6.72 41.15,7.48 41.15,8.24 28.01,13.24 38.91,37.11 38.91,36.25 38.91,35.39 38.91,34.53 31.92,9.86 27.24,14.54 27.23,10.95 29.96,5.6 30.68,5.6 38.04,9.28 37.95,9.96 52.55,28.11 53.85,28.76 52.55,28.76 56.46,26.15 56.47,25.52 55.22,24.74 52.8,24.71 47.29,28.73 47.29,27.97 46.68,21.37 45.52,24.54 46.28,24.54 47.04,24.54 51,26.34 15.64,15.45 16.15,14.94 8.27,13.33 15.41,14.46 14.27,10.95 13.77,10.44 21.88,13.66 26.97,18.82 27.74,17.55 16.05,2.82 16.05,2.06 19.4,4.3 20.17,4.3 5.13,40.67 5.13,4.34 3.35,23.39 61.26,23.39
  pour Ground (isolate 0.254, rank 6, no thermals): -2.72,47.37 -2.72,-3.23 69.11,-3.23 69.11,47.37
  pour Top (no thermals): 27.71,28.13 27.71,25.73 27.91,25.53 27.97,25.53 28.73,26.29 29.64,26.29 29.77,26.42 29.77,28.13
  pour Top (isolate 0.254, rank 6, no thermals): -1.98,46.46 -1.98,-2.24 68.25,-2.24 68.25,46.46
  pour Bottom (isolate 0.254, rank 6, no thermals): -4.42,49.35 -4.42,-5.31 70.82,-5.31 70.82,49.35
  pour Bottom (no thermals): 44.34,38.38 44.34,39.25 42.16,39.25 42.16,42.43 44.58,42.43 44.58,38.38
  pour Bottom (no thermals): 36.53,38.64 36.53,39.14 37.49,39.14 37.49,38.64
  pour Bottom (no thermals): 42.93,11.96 42.93,10.44 46.59,10.44 46.59,11.96
  pour Bottom (no thermals): 31.41,18.82 31.41,18.18 32.05,18.18 32.05,18.82
  pour Bottom (no thermals): 31.43,17.17 31.43,16.53 32.6,16.53 32.6,17.17
  pour Top (rank 2, no thermals): 31.04,14.57 31.04,12.98 32.59,12.98 32.59,14.57
  pour Bottom (no thermals): 34.34,23.56 34.34,22.16 35.64,22.16 35.64,23.56
  pour Bottom (no thermals): 35.61,38.63 35.61,39.74 33.42,39.74 33.42,43.09 35.84,43.09 35.84,38.63
  pour Top (no thermals): 34.89,29.88 34.89,29.32 35.68,29.32 35.68,29.88
  pour Bottom (no thermals): 16.31,37.11 17.25,36.17 19.31,38.23 18.37,39.17
  pour Bottom (no thermals): 19.54,34.37 21.23,32.68 23.26,34.71 21.57,36.4
  pour Top (no thermals): 15.27,35.18 15.67,34.78 16.24,35.36 15.85,35.76
  pour Top (rank 2, no thermals): 14.62,35.49 20.48,29.64 26.32,35.48 20.47,41.33
  pour Bottom (rank 2, no thermals): 34.34,18.55 34.34,17.19 34.99,17.19 34.99,18.55
  pour Top (no thermals): 48.38,7.38 48.38,6.25 48.9,6.25 48.9,7.38
  pour Bottom (rank 4, no thermals): 31.8,21.74 31.8,11.71 41.96,11.71 41.96,21.74
  pour Top (rank 3, no thermals): 50.51,24.3 57.18,24.3 57.18,30.62 50.51,30.62
  pour Top (rank 4, no thermals): 31.8,21.74 31.8,11.71 41.96,11.71 41.96,21.74
  pour Bottom (no thermals): 28.52,18.94 28.52,15.75 29.39,15.75 29.39,18.94
  pour Bottom (rank 3, no thermals): 24.18,31.9 24.18,22.74 33.32,22.74 33.32,31.9
  pour Bottom (no thermals): 45.1,6.88 45.1,3.67 45.77,3.67 45.77,5.1 46.53,5.1 46.53,5.47 45.77,5.47 45.77,6.88
  pour Top (no thermals): 25.09,13.58 25.09,11.08 25.31,11.08 25.31,12.9 28.31,12.9 28.31,13.58
  pour Bottom (no thermals): 38.3,10.23 37.02,10.23 37.02,7.65 37.64,7.65 37.64,9.02 38.3,9.02
  pour Bottom (no thermals): 29.51,6.38 29.51,5.32 31.03,5.32 31.03,5.85 29.81,5.85 29.81,6.38
  pour Bottom (no thermals): 25.78,12.56 25.2,12.56 25.2,13.41 23.42,13.41 23.42,14.5 25.78,14.5
  pour Top (no thermals): 52.17,29.12 52.17,26.95 53.64,26.95 53.64,27.25 52.82,27.25 52.82,29.12
  pour Top: 53.9,28.98 arc90 53.64,28.73 arc90 54.04,28.33 54.25,28.33 54.25,28.63 arc90
  pour Bottom (rank 2, no thermals): 60.47,34.81 58.54,34.81 58.54,34.28 60.47,34.28
  pour Bottom (rank 2, no thermals): 50.86,34.79 50.86,34.28 53.26,34.28 53.26,34.79
  pour Bottom (no thermals): 16.56,16.79 15.19,15.41 16.1,14.5 17.48,15.87
  pour Top (no thermals): 16.59,14.98 14.15,12.54 13.23,13.46 15.67,15.9
  pour Top (no thermals): 8.69,15.52 7.04,13.87 8.12,12.8 9.77,14.44
GNDPLL0  (via drill 0.25)
  other vias: 29.15,22.24 29.15,21.64
  pour Bottom (no thermals): 27.27,22.38 27.27,21.22 29.59,21.22 29.59,23.28 29.01,23.28 29.01,22.38
  pour Top (no thermals): 28.61,23.45 28.61,21.4 29.46,21.4 29.46,23.45
GNDPLL1  (via drill 0.25)
  other vias: 28.33,29.36
  pour Top (rank 4, no thermals): 27.85,29.84 27.85,29.16 28.52,29.16 28.52,29.84
  pour Bottom (no thermals): 26.97,32.38 26.97,31.01 27.74,31.01 27.74,29.18 28.53,29.18 28.53,30.76 28.16,30.76 28.16,32.38
ICE_CDONE  (via drill 0.25)
  Top 0.127: U15.K8 v30.74,24.53 | U19.C2 v33.33,20.27 | v31.35,20.1 30.95,20.5 R18.2 v30.61,21.2
  Bottom 0.127: v30.74,24.53 30.74,23.76 30.46,23.48 30.46,21.34 v30.61,21.2 | v31.35,20.1 31.56,20.1 31.82,19.84 32.91,19.84 v33.33,20.27
ICE_CRST_  (via drill 0.25)
  Top 0.127: U15.L9 31.16,22.74 v31.35,22.55 31.35,22.32 31.79,21.89 31.79,19.79 v31.51,19.52 | v33.33,19.61 | v33.33,19.61 U19.C3
  Bottom 0.127: R19.2 31.53,22.73 v31.35,22.55 | v31.51,19.52 31.53,19.53 33.25,19.53 v33.33,19.61
ICE_IMG_CLK16MHZ
  Top 0.127: 34.19,29.08 36.27,29.08 X2.2 38.06,29.4 38.74,30.08 U16.2 | TP2.X 34.19,29.08 | U15.C11 33.42,29.08 34.19,29.08
ICE_LED0
  Top 0.127: U15.C9 31.61,30.2 31.61,31.48 32.44,32.3 32.44,33.56 33.19,34.32 33.19,35.52 34.78,37.11 LED4.A
ICE_LED1
  Top 0.127: U15.A10 32.67,32.06 33.12,32.06 33.44,32.38 33.44,34.96 34.73,36.25 LED3.A
ICE_LED2
  Top 0.127: LED2.A 34.73,35.39 33.83,34.49 33.83,32.41 33.22,31.8 33.19,31.8 32.87,31.48 32.87,31.46 U15.A11
ICE_LED3
  Top 0.127: LED1.A 34.93,34.53 34.17,33.77 34.17,31.42 33.55,30.8 33.02,30.8 U15.B11
ICE_MSP_SPI_AUX  (via drill 0.25)
  Top 0.127: U15.K3 26.36,24.12 v25.97,23.74 | v25.76,19.45 25.71,19.4 25.71,18.45 U13.10
  Bottom 0.127: v25.76,19.45 26.03,19.72 26.03,23.68 v25.97,23.74
ICE_MSP_SPI_AUX_DIR
  Top 0.127: U12.13 26.19,15.69 26.7,16.19 U13.5
ICE_MSP_SPI_AUX_X
  Top 0.127: U12.14 25.65,14.96 U13.3
ICE_MSP_SPI_CLK  (via drill 0.25)
  Top 0.127: U15.K2 25.55,24.1 v25.2,23.74 | v25.08,19.46 25.31,19.23 25.31,18.45 U13.11
  Bottom 0.127: v25.08,19.46 v25.08,19.47 25.2,19.59 v25.2,23.74
ICE_MSP_SPI_CLK_X
  Top 0.127: U12.15 25.25,14.98 U13.2
ICE_MSP_SPI_DATA  (via drill 0.25)
  Top 0.127: U15.K1 24.75,24.07 v24.42,23.73 | v24.49,19.45 24.91,19.04 24.91,18.45 U13.12
  Bottom 0.127: v24.49,19.45 24.49,23.66 v24.42,23.73
ICE_MSP_SPI_DATA_DIR
  Top 0.127: U13.15 24.2,17.34 23.58,17.34 23.19,16.96 U12.19
ICE_MSP_SPI_DATA_X
  Top 0.127: U13.1 24.85,15.08 U12.16 U12.17
ICE_ST_SPI_CLK  (via drill 0.25)
  Top 0.127: U19.M6 v35.28,13.77 v35.28,13.76 | v32.03,13.76 32.06,13.79 32.06,21.81 32.36,22.11 32.36,22.58 31.95,22.98 U15.L10
  Bottom 0.127: v35.28,13.76 v35.28,13.76 arc90 35.06,13.54 35.06,13.19 arc-90 34.83,12.97 34.79,12.97 arc-90 34.56,13.19 34.56,13.54 arc90 34.34,13.76 34.3,13.76 arc90 34.07,13.54 34.07,13.19 arc-90 33.85,12.97 33.8,12.97 arc-90 33.58,13.19 33.58,13.54 arc90 33.36,13.76 v32.03,13.76
ICE_ST_SPI_CS_
  Top 0.127: U15.K10 32.27,23.82 arc-45 32.31,23.73 32.31,23.06 arc45 32.35,22.97 32.69,22.63 arc-45 32.72,22.55 32.72,21.73 arc90 32.91,21.54 arc90 33.1,21.73 33.1,22.3 arc-90 33.23,22.43 33.31,22.43 arc-90 33.45,22.29 33.45,21.77 arc90 33.65,21.58 33.7,21.58 arc90 33.88,21.75 33.88,23.6 arc-90 34.04,23.77 arc-90 34.21,23.6 34.21,21.77 arc90 34.4,21.58 arc90 34.58,21.77 34.58,23.65 arc-90 34.72,23.79 arc-90 34.87,23.63 34.87,22.38 34.88,22.38 34.88,21.89 arc45 34.91,21.8 35.24,21.48 arc-45 35.28,21.39 35.28,20.97 arc45 35.31,20.88 U19.B6
ICE_ST_SPI_D0  (via drill 0.25)
  Top 0.127: U15.J9 31.61,24.48 31.61,22.94 31.93,22.62 v31.93,22.41 | U19.F14 41.17,18.35 41.17,20.64 40.86,20.95 40.66,20.95 40.45,21.16 40.45,21.36 40.2,21.61 v39.82,21.61
  Bottom 0.127: v39.82,21.61 36.46,21.61 36.04,22.04 35.69,22.04 35.36,21.7 33.54,21.7 33,22.25 32.09,22.25 v31.93,22.41
ICE_ST_SPI_D1  (via drill 0.25)
  Top 0.127: U15.K9 31.16,23.82 30.81,23.47 30.81,22.48 31.38,21.91 31.38,20.98 v31.36,20.95 | U19.B14 40.65,20.59 arc-45 40.56,20.62 40.31,20.87 arc45 40.22,20.91 39.39,20.91 arc-45 39.3,20.94 39.21,21.04 arc-45 39.17,21.13 39.17,22.36 arc90 39.05,22.49 38.8,22.49 arc90 38.67,22.36 38.67,21.62 arc-45 38.63,21.54 38.57,21.47 arc45 38.53,21.38 v38.53,20.92
  Bottom 0.127: v38.53,20.92 38.5,20.95 v31.36,20.95
ICE_ST_SPI_D2  (via drill 0.25)
  Top 0.127: U19.K1 v32.68,15.06 | U15.L7 29.63,23.26 29.63,21.36 arc-90 29.41,21.14 29.31,21.14 arc90 29.09,20.92 29.09,20.86 arc90 29.31,20.64 29.41,20.64 arc-90 29.63,20.42 29.63,20.36 arc-90 29.41,20.14 29.31,20.14 arc90 29.09,19.91 29.09,19.86 arc90 29.31,19.64 29.41,19.64 arc-90 29.63,19.41 29.63,19.36 arc-90 29.45,19.18 29.32,19.18 arc90 29.1,18.96 29.1,18.9 arc90 29.32,18.68 29.36,18.68 arc-90 29.63,18.41 29.63,18.35 arc-90 29.43,18.15 29.27,18.15 arc90 29.05,17.93 29.05,17.87 arc90 29.27,17.65 29.39,17.65 arc-90 29.63,17.41 29.63,17.35 arc-90 29.41,17.13 29.31,17.13 arc90 29.09,16.91 29.09,16.85 arc90 29.31,16.63 29.41,16.63 arc-90 29.63,16.41 29.63,16.26 arc-90 29.48,16.1 29.38,16.1 arc90 29.16,15.88 29.16,15.82 arc90 29.38,15.6 29.48,15.6 arc-90 29.7,15.38 29.7,15.13 29.8,15.02 29.96,15.02 29.97,15.01 v30.61,15.01
  Bottom 0.127: v32.68,15.06 32.63,15.01 v30.61,15.01
ICE_ST_SPI_D3  (via drill 0.25)
  Top 0.127: U19.K2 v33.33,15.06 | v29.79,14.61 29.13,14.61 28.26,15.48 28.26,22.85 28.37,22.96 28.37,23.75 U15.K6
  Bottom 0.127: v29.79,14.61 29.84,14.55 30.4,14.55 arc-90 30.62,14.33 30.62,14.18 arc90 30.84,13.96 30.85,13.96 arc90 31.07,14.18 31.07,14.33 arc-90 31.29,14.55 33.18,14.55 33.33,14.71 v33.33,15.06
ICE_ST_SPI_D4  (via drill 0.25)
  Top 0.127: U15.J7 29.9,24.59 v29.9,24.57 | v33.98,18.96 34.01,18.98 34.06,18.93 34.43,18.93 34.6,18.76 34.6,18.14 34.44,17.99 U19.F4
  Bottom 0.127: v29.9,24.57 29.9,20.73 29.29,20.12 arc-45 29.2,20.08 28.27,20.08 arc45 28.18,20.04 28.04,19.9 arc45 28,19.81 28,19.56 arc45 28.04,19.47 arc45 28.38,19.33 28.66,19.33 arc90 28.88,19.55 28.88,19.59 arc-90 29.11,19.81 29.22,19.81 arc-90 29.44,19.59 29.44,19.55 arc90 29.66,19.33 29.78,19.33 arc90 30,19.55 30,19.59 arc-90 30.22,19.82 30.34,19.82 arc-90 30.56,19.59 30.56,19.55 arc90 30.78,19.33 31.11,19.33 31.34,19.1 33.84,19.1 v33.98,18.96
ICE_ST_SPI_D5  (via drill 0.25)
  Top 0.127: U15.K7 29.55,23.82 29.9,23.48 29.9,16.6 v30.2,16.3 | U19.G4 34.75,16.9 v34.75,16.53
  Bottom 0.127: v34.75,16.53 34.55,16.33 31.63,16.33 arc-90 31.62,16.33 31.4,16.33 arc45 31.15,16.23 arc45 31.05,15.98 31.05,15.76 arc-90 30.94,15.65 30.91,15.65 arc-90 30.78,15.77 30.78,16.25 arc90 30.65,16.38 30.64,16.38 arc90 30.51,16.25 30.51,15.8 arc-90 30.39,15.68 30.32,15.68 arc-90 30.2,15.8 v30.2,16.3
ICE_ST_SPI_D6  (via drill 0.25)
  Top 0.127: U19.C10 v38.53,20.26 | U15.H7 29.58,25.74 v29.98,25.34
  Bottom 0.127: v29.98,25.34 30.32,25 30.32,23.83 arc-45 30.32,23.82 30.25,23.75 arc45 30.19,23.62 30.19,20.5 arc90 30.31,20.38 arc90 30.42,20.49 30.42,20.65 arc-90 30.55,20.78 arc-90 30.66,20.66 30.66,20.16 arc90 30.8,20.01 arc90 30.93,20.14 30.93,20.25 arc-90 31.21,20.52 31.53,20.52 arc45 31.62,20.56 31.71,20.65 arc-45 31.8,20.69 38.05,20.69 arc-45 38.14,20.65 v38.53,20.26
ICE_ST_SPI_D7  (via drill 0.25)
  Top 0.127: U15.L8 30.35,22.29 v30.95,21.7 | v35.87,21.61 36.08,21.83 arc45 36.12,21.92 36.12,23.18 arc-90 36.25,23.3 36.5,23.3 arc-90 36.63,23.18 36.63,22 arc90 36.75,21.87 37.01,21.87 arc90 37.13,22 37.13,23.18 arc-90 37.26,23.3 37.52,23.3 arc-90 37.64,23.18 37.64,21.86 arc-45 37.56,21.66 arc-45 37.36,21.57 36.64,21.57 arc45 36.55,21.54 U19.A7
  Bottom 0.127: v30.95,21.7 31.27,21.38 35.63,21.38 v35.87,21.61
IMG_CLK16MHZ
  Top 0.127: U17.D7 53.19,29.42 53.19,29.93 52.35,30.76 47.8,30.76 46.47,29.43 U16.4
IMG_D0  (via drill 0.25)
  Top 0.127: v55.8,28.76 U17.G6 | v30.76,28.55 v30.76,28.54 U15.E8
  Bottom 0.127: v55.8,28.76 55.8,29.68 55.38,30.1 45.86,30.1 44.68,28.92 31.13,28.92 v30.76,28.55
IMG_D1  (via drill 0.25)
  Top 0.127: U17.G5 | v55.8,28.11 U17.G5 | v36.19,28.25 35.92,28.53 32.36,28.53 U15.D10
  Bottom 0.127: v55.8,28.11 55.38,28.53 55.38,29.38 54.96,29.8 46.02,29.8 46.02,29.79 45.98,29.79 44.31,28.12 39.17,28.12 arc-90 38.95,28.34 38.95,28.44 arc90 38.72,28.66 38.7,28.66 arc90 38.48,28.44 38.48,28.34 arc-90 38.26,28.12 38.23,28.12 arc-90 38.01,28.34 38.01,28.44 arc90 37.79,28.66 37.77,28.66 arc90 37.55,28.44 37.55,28.34 arc-90 37.32,28.12 36.32,28.12 v36.19,28.25
IMG_D2  (via drill 0.25)
  Top 0.127: U17.H4 v55.8,27.45 v55.8,27.46 | v35.69,26.18 35.38,26.48 32.81,26.48 U15.G11
  Bottom 0.127: v55.8,27.46 v55.79,27.46 55.1,26.77 47.2,26.77 46.61,26.18 46.02,26.18 arc-90 45.8,26.4 45.8,26.41 arc90 45.58,26.63 45.34,26.63 arc90 45.12,26.41 45.12,26.4 arc-90 44.89,26.18 44.65,26.18 arc-90 44.43,26.4 44.43,26.41 arc90 44.21,26.63 43.97,26.63 arc90 43.74,26.41 43.74,26.4 arc-90 43.52,26.18 43.28,26.18 arc-90 43.06,26.4 43.06,26.41 arc90 42.84,26.63 42.59,26.63 arc90 42.37,26.41 42.37,26.4 arc-90 42.15,26.18 41.91,26.18 arc-90 41.69,26.4 41.69,26.41 arc90 41.46,26.63 41.22,26.63 arc90 41,26.41 41,26.4 arc-90 40.78,26.18 40.54,26.18 arc-90 40.31,26.4 40.31,26.41 arc90 40.09,26.63 39.85,26.63 arc90 39.63,26.41 39.63,26.4 arc-90 39.41,26.18 39.16,26.18 arc-90 38.94,26.4 38.94,26.41 arc90 38.72,26.63 38.48,26.63 arc90 38.26,26.41 38.26,26.4 arc-90 38.03,26.18 37.79,26.18 arc-90 37.57,26.4 37.57,26.41 arc90 37.35,26.63 37.11,26.63 arc90 36.88,26.41 36.88,26.4 arc-90 36.66,26.18 v35.69,26.18
IMG_D3  (via drill 0.25)
  Top 0.127: U17.G4 v55.15,27.45 | v31.55,26.87 31.22,26.54 U15.G9
  Bottom 0.127: v55.15,27.45 54.72,27.02 36.63,27.02 arc90 36.41,26.8 36.41,26.77 arc-90 36.18,26.54 36.16,26.54 arc-90 35.93,26.77 35.93,26.8 arc90 35.71,27.02 35.68,27.02 arc90 35.46,26.8 35.46,26.77 arc-90 35.24,26.54 35.21,26.54 arc-90 34.99,26.77 34.99,26.8 arc90 34.77,27.02 34.74,27.02 arc90 34.52,26.8 34.52,26.77 arc-90 34.29,26.54 34.27,26.54 arc-90 34.04,26.77 34.04,26.8 arc90 33.82,27.02 33.79,27.02 arc90 33.57,26.8 33.57,26.77 arc-90 33.35,26.54 33.32,26.54 arc-90 33.1,26.77 33.1,26.8 arc90 32.88,27.02 32.85,27.02 arc90 32.63,26.8 32.63,26.77 arc-90 32.41,26.54 32.38,26.54 arc-90 32.16,26.77 32.16,26.8 arc90 31.93,27.02 31.7,27.02 v31.55,26.87
IMG_D4  (via drill 0.25)
  Top 0.127: v55.15,28.11 U17.F5 | v31.55,28.49 31.5,28.49 U15.E9
  Bottom 0.127: v55.15,28.11 55.13,28.13 55.13,29.2 54.78,29.54 46.08,29.54 44.38,27.83 36.02,27.83 35.26,28.59 35.16,28.59 arc90 34.93,28.36 arc-90 34.71,28.14 34.66,28.14 arc-90 34.44,28.36 arc90 34.21,28.59 34.16,28.59 arc90 33.94,28.36 arc-90 33.71,28.14 33.66,28.14 arc-90 33.44,28.36 arc90 33.22,28.59 31.65,28.59 v31.55,28.49
IMG_D5  (via drill 0.25)
  Top 0.127: U17.G3 v55.15,26.16 | v35.43,23.97 35.01,24.4 33.01,24.4 U15.K11
  Bottom 0.127: v55.15,26.16 54.78,25.8 54.78,23.98 53.33,22.53 48.25,22.53 47.14,23.64 39.42,23.64 arc90 39.2,23.42 39.2,23.36 arc-90 38.98,23.14 38.92,23.14 arc-90 38.7,23.36 38.7,23.42 arc90 38.48,23.64 38.42,23.64 arc90 38.2,23.42 38.2,23.36 arc-90 37.98,23.14 37.93,23.14 arc-90 37.71,23.36 37.71,23.42 arc90 37.48,23.64 37.43,23.64 arc90 37.21,23.42 37.21,23.36 arc-90 36.99,23.14 36.93,23.14 arc-90 36.71,23.36 36.71,23.42 arc90 36.49,23.64 35.76,23.64 v35.43,23.97
IMG_D6  (via drill 0.25)
  Top 0.127: U17.F4 v54.5,27.45 | U15.F9 31.16,27.4 v31.56,27.8
  Bottom 0.127: v54.5,27.45 54.72,27.68 54.72,29.03 54.48,29.28 46.18,29.28 44.48,27.57 33.07,27.57 arc-90 32.85,27.79 32.85,28.1 arc90 32.63,28.32 32.46,28.32 arc90 32.24,28.1 32.24,27.79 arc-90 32.02,27.57 31.79,27.57 v31.56,27.8
IMG_D7  (via drill 0.25)
  Top 0.127: U17.E4 53.84,27.46 53.2,27.46 v53.2,27.45 | U15.G8 v30.76,26.95
  Bottom 0.127: v30.76,26.95 31.11,27.3 45.18,27.3 arc90 45.4,27.53 45.4,27.99 arc-90 45.65,28.24 arc-90 45.87,28.03 45.87,27.53 arc90 46.09,27.3 46.11,27.3 arc90 46.32,27.52 46.32,28.33 arc-90 46.55,28.55 46.57,28.55 arc-90 46.79,28.33 46.79,27.54 arc90 47.03,27.3 53.05,27.3 v53.2,27.45
IMG_D8  (via drill 0.25)
  Top 0.127: U17.F3 v54.5,26.16 | v32.36,24.54 U15.J10
  Bottom 0.127: v54.5,26.16 54.5,24.29 52.99,22.78 48.36,22.78 47.23,23.91 40.69,23.91 arc-90 40.47,24.13 40.47,24.13 arc90 40.25,24.36 40.24,24.36 arc90 40.02,24.13 40.02,24.13 arc-90 39.8,23.91 39.8,23.91 arc-90 39.57,24.13 39.57,24.13 arc90 39.35,24.36 39.35,24.36 arc90 39.13,24.13 39.13,24.13 arc-90 38.9,23.91 38.9,23.91 arc-90 38.68,24.13 38.68,24.13 arc90 38.46,24.36 38.45,24.36 arc90 38.23,24.13 38.23,24.13 arc-90 38.01,23.91 36.11,23.91 35.63,24.39 32.51,24.39 v32.36,24.54
IMG_D9  (via drill 0.25)
  Top 0.127: U17.E3 v53.85,26.16 | U15.J11 32.85,24.84 v33.3,24.84
  Bottom 0.127: v53.85,26.16 53.22,25.53 50.79,25.53 50.58,25.74 47.24,25.74 46.66,25.16 45.26,25.16 arc90 45.04,24.94 45.04,24.91 arc-90 44.82,24.69 44.81,24.69 arc-90 44.59,24.91 44.59,24.94 arc90 44.37,25.16 44.36,25.16 arc90 44.13,24.94 44.13,24.91 arc-90 43.91,24.69 43.9,24.69 arc-90 43.68,24.91 43.68,24.94 arc90 43.46,25.16 43.45,25.16 arc90 43.23,24.94 43.23,24.91 arc-90 43.01,24.69 43,24.69 arc-90 42.77,24.91 42.77,24.94 arc90 42.55,25.16 42.54,25.16 arc90 42.32,24.94 42.32,24.91 arc-90 42.1,24.69 42.09,24.69 arc-90 41.87,24.91 41.87,24.94 arc90 41.65,25.16 41.64,25.16 arc90 41.41,24.94 41.41,24.91 arc-90 41.19,24.69 41.18,24.69 arc-90 40.96,24.91 40.96,24.94 arc90 40.74,25.16 40.73,25.16 arc90 40.51,24.94 40.51,24.91 arc-90 40.29,24.69 40.28,24.69 arc-90 40.06,24.91 40.06,24.94 arc90 39.83,25.16 39.83,25.16 arc90 39.6,24.94 39.6,24.91 arc-90 39.38,24.69 39.37,24.69 arc-90 39.15,24.91 39.15,24.94 arc90 38.93,25.16 38.92,25.16 arc90 38.7,24.94 38.7,24.91 arc-90 38.47,24.69 38.47,24.69 arc-90 38.24,24.91 38.24,24.94 arc90 38.02,25.16 38.01,25.16 arc90 37.79,24.94 37.79,24.91 arc-90 37.57,24.69 37.56,24.69 arc-90 37.34,24.91 37.34,24.94 arc90 37.12,25.16 37.11,25.16 arc90 36.88,24.94 36.88,24.91 arc-90 36.66,24.69 36.65,24.69 arc-90 36.43,24.91 36.43,24.94 arc90 36.21,25.16 33.61,25.16 v33.3,24.84
IMG_D10  (via drill 0.25)
  Top 0.127: U17.D3 v53.2,26.16 | v35.05,25.58 34.95,25.68 32.81,25.68 U15.H11
  Bottom 0.127: v53.2,26.16 52.82,25.78 50.9,25.78 50.69,26 47.07,26 46.49,25.42 arc-90 46.27,25.64 46.27,25.68 arc90 46.05,25.9 46.03,25.9 arc90 45.81,25.68 45.81,25.64 arc-90 45.59,25.42 45.57,25.42 arc-90 45.34,25.64 45.34,25.68 arc90 45.12,25.9 45.1,25.9 arc90 44.88,25.68 44.88,25.64 arc-90 44.66,25.42 44.64,25.42 arc-90 44.42,25.64 44.42,25.68 arc90 44.2,25.9 44.18,25.9 arc90 43.96,25.68 43.96,25.64 arc-90 43.73,25.42 43.72,25.42 arc-90 43.49,25.64 43.49,25.68 arc90 43.27,25.9 43.25,25.9 arc90 43.03,25.68 43.03,25.64 arc-90 42.81,25.42 42.79,25.42 arc-90 42.57,25.64 42.57,25.68 arc90 42.35,25.9 42.33,25.9 arc90 42.11,25.68 42.11,25.64 arc-90 41.88,25.42 41.87,25.42 arc-90 41.64,25.64 41.64,25.68 arc90 41.42,25.9 41.4,25.9 arc90 41.18,25.68 41.18,25.64 arc-90 40.96,25.42 40.94,25.42 arc-90 40.72,25.64 40.72,25.68 arc90 40.5,25.9 40.48,25.9 arc90 40.26,25.68 40.26,25.64 arc-90 40.03,25.42 40.02,25.42 arc-90 39.79,25.64 39.79,25.68 arc90 39.57,25.9 39.55,25.9 arc90 39.33,25.68 39.33,25.64 arc-90 39.11,25.42 39.09,25.42 arc-90 38.87,25.64 38.87,25.68 arc90 38.65,25.9 38.63,25.9 arc90 38.41,25.68 38.41,25.64 arc-90 38.18,25.42 38.17,25.42 arc-90 37.94,25.64 37.94,25.68 arc90 37.72,25.9 37.7,25.9 arc90 37.48,25.68 37.48,25.64 arc-90 37.26,25.42 37.24,25.42 arc-90 37.02,25.64 37.02,25.68 arc90 36.8,25.9 36.78,25.9 arc90 36.56,25.68 36.56,25.64 arc-90 36.33,25.42 35.21,25.42 v35.05,25.58
IMG_D11
  Top 0.127: U17.E2 54.46,25.54 54.46,24.25 53.85,23.64 44.19,23.64 arc90 43.96,23.42 43.96,23.41 arc-90 43.74,23.19 43.65,23.19 arc-90 43.43,23.41 43.43,23.42 arc90 43.2,23.64 43.11,23.64 arc90 42.89,23.42 42.89,23.41 arc-90 42.67,23.19 42.58,23.19 arc-90 42.35,23.41 42.35,23.42 arc90 42.13,23.64 42.04,23.64 arc90 41.82,23.42 41.82,23.41 arc-90 41.59,23.19 41.5,23.19 arc-90 41.28,23.41 41.28,23.42 arc90 41.06,23.64 40.97,23.64 arc90 40.74,23.42 40.74,23.41 arc-90 40.52,23.19 40.43,23.19 arc-90 40.21,23.41 40.21,23.42 arc90 39.99,23.64 39.89,23.64 arc90 39.67,23.42 39.67,23.41 arc-90 39.45,23.19 39.36,23.19 arc-90 39.13,23.41 39.13,23.42 arc90 38.91,23.64 36.36,23.64 34.72,25.28 32.41,25.28 U15.H10
IMG_DCLK  (via drill 0.25)
  Top 0.127: U17.E1 v53.84,25.51 | v50.41,25.31 44.76,25.31 arc90 44.53,25.09 44.53,24.96 arc-90 44.31,24.74 44.28,24.74 arc-90 44.06,24.96 44.06,25.09 arc90 43.83,25.31 43.8,25.31 arc90 43.58,25.09 43.58,24.96 arc-90 43.36,24.74 43.33,24.74 arc-90 43.1,24.96 43.1,25.09 arc90 42.88,25.31 42.85,25.31 arc90 42.63,25.09 42.63,24.96 arc-90 42.41,24.74 42.37,24.74 arc-90 42.15,24.96 42.15,25.09 arc90 41.93,25.31 41.9,25.31 arc90 41.67,25.09 41.67,24.96 arc-90 41.45,24.74 41.42,24.74 arc-90 41.2,24.96 41.2,25.09 arc90 40.98,25.31 40.94,25.31 arc90 40.72,25.09 40.72,24.96 arc-90 40.5,24.74 40.47,24.74 arc-90 40.24,24.96 40.24,25.09 arc90 40.02,25.31 39.99,25.31 arc90 39.77,25.09 39.77,24.96 arc-90 39.55,24.74 39.51,24.74 arc-90 39.29,24.96 39.29,25.09 arc90 39.07,25.31 39.04,25.31 arc90 38.81,25.09 38.81,24.96 arc-90 38.59,24.74 38.56,24.74 arc-90 38.34,24.96 38.34,25.09 arc90 38.12,25.31 37.59,25.31 35.57,27.34 U15.F11
  Bottom 0.127: v53.84,25.51 53.6,25.27 50.46,25.27 v50.41,25.31
IMG_FV
  Top 0.127: U17.B3 51.87,26.84 50.85,26.84 arc-90 50.63,27.06 50.63,27.08 arc90 50.41,27.31 50.39,27.31 arc90 50.17,27.08 50.17,27.06 arc-90 49.95,26.84 49.93,26.84 arc-90 49.71,27.06 49.71,27.08 arc90 49.48,27.31 49.47,27.31 arc90 49.24,27.08 49.24,27.06 arc-90 49.02,26.84 49.01,26.84 arc-90 48.78,27.06 48.78,27.08 arc90 48.56,27.31 48.55,27.31 arc90 48.32,27.08 48.32,27.06 arc-90 48.1,26.84 48.08,26.84 arc-90 47.86,27.06 47.86,27.08 arc90 47.64,27.31 47.62,27.31 arc90 47.4,27.08 47.4,27.06 arc-90 47.18,26.84 47.16,26.84 arc-90 46.94,27.06 46.94,27.08 arc90 46.72,27.31 46.7,27.31 arc90 46.48,27.08 46.48,27.06 arc-90 46.26,26.84 46.24,26.84 arc-90 46.02,27.06 46.02,27.08 arc90 45.79,27.31 45.78,27.31 arc90 45.55,27.08 45.55,27.06 arc-90 45.33,26.84 45.32,26.84 arc-90 45.09,27.06 45.09,27.08 arc90 44.87,27.31 44.85,27.31 arc90 44.63,27.08 44.63,27.06 arc-90 44.41,26.84 44.39,26.84 arc-90 44.17,27.06 44.17,27.08 arc90 43.95,27.31 43.93,27.31 arc90 43.71,27.08 43.71,27.06 arc-90 43.49,26.84 43.47,26.84 arc-90 43.25,27.06 43.25,27.08 arc90 43.03,27.31 43.01,27.31 arc90 42.79,27.08 42.79,27.06 arc-90 42.57,26.84 42.55,26.84 arc-90 42.33,27.06 42.33,27.08 arc90 42.1,27.31 42.09,27.31 arc90 41.87,27.08 41.87,27.06 arc-90 41.64,26.84 41.63,26.84 arc-90 41.41,27.06 41.41,27.08 arc90 41.18,27.31 41.17,27.31 arc90 40.94,27.08 40.94,27.06 arc-90 40.72,26.84 40.7,26.84 arc-90 40.48,27.06 40.48,27.08 arc90 40.26,27.31 40.24,27.31 arc90 40.02,27.08 40.02,27.06 arc-90 39.8,26.84 39.78,26.84 arc-90 39.56,27.06 39.56,27.08 arc90 39.34,27.31 39.32,27.31 arc90 39.1,27.08 39.1,27.06 arc-90 38.88,26.84 38.86,26.84 arc-90 38.64,27.06 38.64,27.08 arc90 38.41,27.31 38.4,27.31 arc90 38.18,27.08 38.18,27.06 arc-90 37.95,26.84 36.79,26.84 35.5,28.13 U15.E11
IMG_LV
  Top 0.127: U17.C3 52.52,26.13 51.44,26.13 51.04,25.74 50.6,25.74 arc-90 50.38,25.96 50.38,25.97 arc90 50.15,26.19 50.05,26.19 arc90 49.83,25.97 49.83,25.96 arc-90 49.6,25.74 49.5,25.74 arc-90 49.28,25.96 49.28,25.97 arc90 49.05,26.19 48.95,26.19 arc90 48.73,25.97 48.73,25.96 arc-90 48.5,25.74 48.4,25.74 arc-90 48.18,25.96 48.18,25.97 arc90 47.95,26.19 47.85,26.19 arc90 47.63,25.97 47.63,25.96 arc-90 47.41,25.74 47.3,25.74 arc-90 47.08,25.96 47.08,25.97 arc90 46.86,26.19 46.75,26.19 arc90 46.53,25.97 46.53,25.96 arc-90 46.31,25.74 46.2,25.74 arc-90 45.98,25.96 45.98,25.97 arc90 45.76,26.19 45.65,26.19 arc90 45.43,25.97 45.43,25.96 arc-90 45.21,25.74 45.1,25.74 arc-90 44.88,25.96 44.88,25.97 arc90 44.66,26.19 44.55,26.19 arc90 44.33,25.97 44.33,25.96 arc-90 44.11,25.74 44.01,25.74 arc-90 43.78,25.96 43.78,25.97 arc90 43.56,26.19 43.45,26.19 arc90 43.23,25.97 43.23,25.96 arc-90 43.01,25.74 42.91,25.74 arc-90 42.68,25.96 42.68,25.97 arc90 42.46,26.19 42.36,26.19 arc90 42.13,25.97 42.13,25.96 arc-90 41.91,25.74 41.81,25.74 arc-90 41.59,25.96 41.59,25.97 arc90 41.36,26.19 41.26,26.19 arc90 41.04,25.97 41.04,25.96 arc-90 40.81,25.74 40.71,25.74 arc-90 40.49,25.96 40.49,25.97 arc90 40.26,26.19 40.16,26.19 arc90 39.94,25.97 39.94,25.96 arc-90 39.72,25.74 39.61,25.74 arc-90 39.39,25.96 39.39,25.97 arc90 39.17,26.19 39.06,26.19 arc90 38.84,25.97 38.84,25.96 arc-90 38.62,25.74 37.53,25.74 35.52,27.75 32.35,27.75 U15.E10
IMG_RST_
  Top 0.127: U17.C8 52.22,30.38 49.07,30.38 | 49.07,30.38 48,30.38 46.44,28.82 32.88,28.82 U15.D11 | R20.1 49.07,29.87 49.07,30.38
IMG_SCLK
  Top 0.127: U17.D1 53.52,24.78 52.66,23.91 37.33,23.91 35.12,26.12 32.36,26.12 31.95,26.53 U15.G10
IMG_SDATA
  Top 0.127: U17.B2 51.91,25.52 51.21,25.52 50.59,24.89 50.1,24.89 | U15.F10 32.37,26.92 35.58,26.92 38.3,24.21 44.46,24.21 45.29,25.03 49.96,25.03 50.1,24.89 | R21.2 49.96,24.75 50.1,24.89
MOTION_SIGNAL  (via drill 0.25, 0.38)
  Top 0.127: U12.10 28.45,12.48 28.75,12.79 v28.75,13.23 | v6.96,29.93 6.4,29.36 6.4,12.96 10.07,9.3 18.76,9.3 v19.29,9.84
  Bottom 0.127: v28.75,13.23 28.75,13.77 27.29,15.23 22.62,15.23 21.13,13.74 21.13,13.08 19.63,11.58 19.63,10.18 v19.29,9.84 | v6.96,29.93 12.28,29.93 U14.2
MSP_RST_  (via drill 0.25)
  Top 0.127: U12.4 24.19,10.66 23.87,10.34 23.52,10.34 23.28,10.59 v23.11,10.76 | U19.R5 v34.63,12.46 v34.63,12.47
  Bottom 0.127: v34.63,12.47 34.57,12.47 33.75,11.65 29.03,11.65 27.31,9.93 23.94,9.93 v23.11,10.75 v23.11,10.76 23.11,11.64 R11.1 C26.1
MSP_TEST  (via drill 0.25)
  Top 0.127: U12.3 v23.7,10.76 | U19.R4 v33.98,12.46
  Bottom 0.127: v33.98,12.46 33.49,11.98 28.96,11.98 27.17,10.19 24.27,10.19 v23.7,10.76
N$1
  pour Bottom (no thermals): 23.28,6.79 23.28,4.27 26.16,4.27 26.16,6.79
N$2  (via drill 0.25)
  other vias: 38.2,14.55
  pour Bottom (no thermals): 37.9,15.52 37.9,14.35 38.41,14.35 38.41,15.52
  pour Top (no thermals): 38,14.76 38,14 38.4,14 38.4,14.76
N$4
  pour Bottom (no thermals): 44.9,35.41 44.9,38.09 45.1,38.09 45.1,37.36 45.94,37.36 45.94,35.41
N$5
  pour Bottom (no thermals): 36.09,35.93 36.09,38.35 36.27,38.35 36.27,37.63 37.11,37.63 37.11,35.93
N$6
  Bottom 0.127: Q3.3 29.26,2.98 R3.2 R4.1
N$7  (via drill 0.25)
  other vias: 39.83,18.31
  pour Bottom (no thermals): 39.6,19.18 39.6,18.06 40.18,18.06 40.18,19.18
  pour Top (no thermals): 40.16,17.84 39.57,18.31 39.87,18.55 40.09,18.36 40.23,18.03
N$8
  pour Bottom (no thermals): 44.65,38.13 44.07,38.13 44.07,38.91 42.9,38.91 42.9,33.44 44.47,33.44 44.47,37.85 44.65,37.85
N$9
  pour Bottom (rank 2, no thermals): 24.11,8.77 24.11,7.53 27.06,7.53 27.06,5.99 29.39,5.99 29.39,6.43 29.77,6.43 29.77,7.52 30.28,7.52 30.28,8.77
N$10
  Top 0.127: R32.2 42.15,15.14 41.46,15.84 U19.J15
N$11
  Bottom 0.254: U5.D1 59,8.53 58.53,8.99 R9.1
  pour Bottom (no thermals): 58.62,8.64 57.12,8.64 57.12,9.3 58.62,9.3
N$12
  Bottom 0.254: U5.B2 U5.B3
  pour Bottom (no thermals): 59.72,7.62 59.72,7.9 63.07,7.9 63.07,6.72 60.59,6.72 60.59,7.62
N$13
  Bottom 0.254: U5.D2 U5.D3
  pour Bottom (no thermals): 59.69,8.33 59.69,8.69 60.65,8.69 60.65,9.68 63.09,9.68 63.09,8.33
N$14
  Top 0.254: X1.4 26.91,9.81 arc-45 U12.8
  Top 0.508: C23.1 27.81,8.92 X1.4
N$15
  pour Bottom (no thermals): 30.41,5.05 30.41,2.82 34.09,2.82 34.09,5.61 32.56,5.61 32.56,9.42 31.29,9.42 31.29,5.05
N$16
  pour Bottom (no thermals): 35.84,38.36 35.3,38.36 35.3,39.41 34.24,39.41 34.24,33.98 35.69,33.98 35.69,38.19 35.84,38.19
N$17
  Top 0.254: X1.1 24.95,9.76 arc45 U12.7
  Top 0.508: C22.1 24.11,8.92 X1.1
N$18
  Bottom 0.254: U5.E2 U5.E3
  pour Bottom (rank 2, no thermals): 58.65,9.55 58.65,10.7 59.69,10.7 59.69,8.84 60.96,8.84 60.96,13.18 58.4,13.18 58.4,11.18 57.91,11.18 57.91,9.55
N$19
  pour Bottom (no thermals): 26.41,4.65 26.41,3.58 30.15,3.58 30.15,5.03 28.5,5.03 28.5,5.65 27.51,5.65 27.51,5.72 26.5,5.72 26.5,4.65
N$20
  Top 0.127: LED3.C R14.1
N$21
  Bottom 0.127: U4.C1 45.56,38.61 R7.2
N$22
  Top 0.127: U12.1 TP1.X
N$23
  Top 0.127: LED4.C R15.1 | R15.1
N$24
  Bottom 0.127: U2.1 36.64,7.49 36.84,7.3 37.72,7.3 37.94,7.51 U2.3
  pour Bottom (rank 2, no thermals): 34.63,11.05 34.63,7.22 41.13,7.22 41.13,11.05
N$25  (via drill 0.25)
  other vias: 41.13,15.06
  pour Top (no thermals): 40.77,16.12 40.77,16 40.97,16 40.94,14.76 41.33,14.76 41.33,16.12
  pour Bottom (no thermals): 40.84,15.27 40.84,14 41.49,14 41.49,15.27
N$26
  Top 0.127: LED2.C R13.1
N$27
  Top 0.127: R30.1 LED8.C
N$28
  Top 0.127: LED1.C R12.1 | R12.1
N$29
  Top 0.127: R29.1 LED7.C
N$30
  Top 0.127: R28.1 LED6.C
N$31
  Top 0.127: R27.1 LED5.C
N$54  (via drill 0.38)
  other vias: 44.63,9.06
  pour Top (no thermals): 44.39,9.31 44.39,8.77 45.64,8.77 45.64,9.31
  pour Bottom (rank 2, no thermals): 44.32,10.05 44.32,4.6 45.01,4.6 45.01,9.42 46.79,9.42 46.79,8.15 47.44,8.15 47.44,10.05
NIL
  cutout Top (no thermals): 22.12,10.46 22.12,2.16 29.74,2.16 29.74,10.46
  cutout Top (no thermals): 15.66,16.49 17.2,14.95 17.42,15.17 15.88,16.71
RAM_A0  (via drill 0.25)
  Top 0.127: U18.H7 v23.28,35.48 v23.29,35.48 | U15.D5 27.6,29.3 v27.6,29.34
  Bottom 0.127: v27.6,29.34 27.6,30.14 arc90 27.23,30.5 arc-90 26.68,31.05 26.68,33.6 arc90 26.43,33.86 24.39,33.86 arc-90 24.27,33.98 arc-90 24.4,34.12 26.44,34.12 arc90 26.57,34.25 arc90 26.44,34.38 24.12,34.38 arc-90 23.98,34.52 arc-90 24.12,34.66 25.92,34.66 arc90 26.04,34.78 arc90 25.88,34.95 23.82,34.95 arc-90 v23.29,35.48
RAM_A1
  Top 0.127: U15.B3 26,30.9 26,34.87 arc-90 26.17,35.03 arc-90 26.31,34.9 26.31,33.08 arc90 26.44,32.94 arc90 26.56,33.06 26.56,38.44 arc90 26.21,38.78 25.74,38.78 arc90 25.6,38.64 arc90 25.74,38.5 26.13,38.5 arc-90 26.26,38.38 arc-90 26.13,38.26 24.9,38.26 arc90 24.65,38 24.65,37.69 arc-38 24.24,36.49 arc33 U18.H8
RAM_A2
  Top 0.127: U15.B2 25.46,30.64 arc-45 25.21,31.23 arc90 24.76,31.68 24.18,31.68 arc-90 24.04,31.82 arc-90 24.16,31.94 25.16,31.94 arc90 25.3,32.08 arc90 25.18,32.2 23.93,32.2 arc-90 23.78,32.35 arc-90 23.89,32.45 25.15,32.45 arc90 25.3,32.6 arc90 25.17,32.73 23.82,32.73 arc-90 23.7,32.84 arc-90 23.84,32.97 arc90 24.34,33.48 24.34,34.42 arc-90 24.47,34.54 arc-90 24.61,34.4 24.61,33.14 arc90 24.77,32.99 arc90 24.89,33.11 24.89,34.44 arc-90 25.03,34.59 arc-90 25.14,34.48 25.14,33.11 arc90 25.27,32.98 arc90 25.37,33.08 25.37,34.77 arc90 25.21,34.93 U18.J8
RAM_A3